# Altium schematic sheet Sheet2.SchDoc
size 420 x 297 mm; ApprovedBy: Судаков; CheckedBy: Сарайкин; Author: Аршаница; CompanyName: ООО "ОКБ Вектор"; Address1: Address1; Address2: Address2; Address3: Address3; Address4: Address4; DocumentNumber: ВГАР.426477.005 Э3; SheetNumber: 1; SheetTotal: 1; Scale: 1:1; ProcessInspection: Казанов; NormInspection: Коваленко; FirstReferrence: ВГАР.426477.005
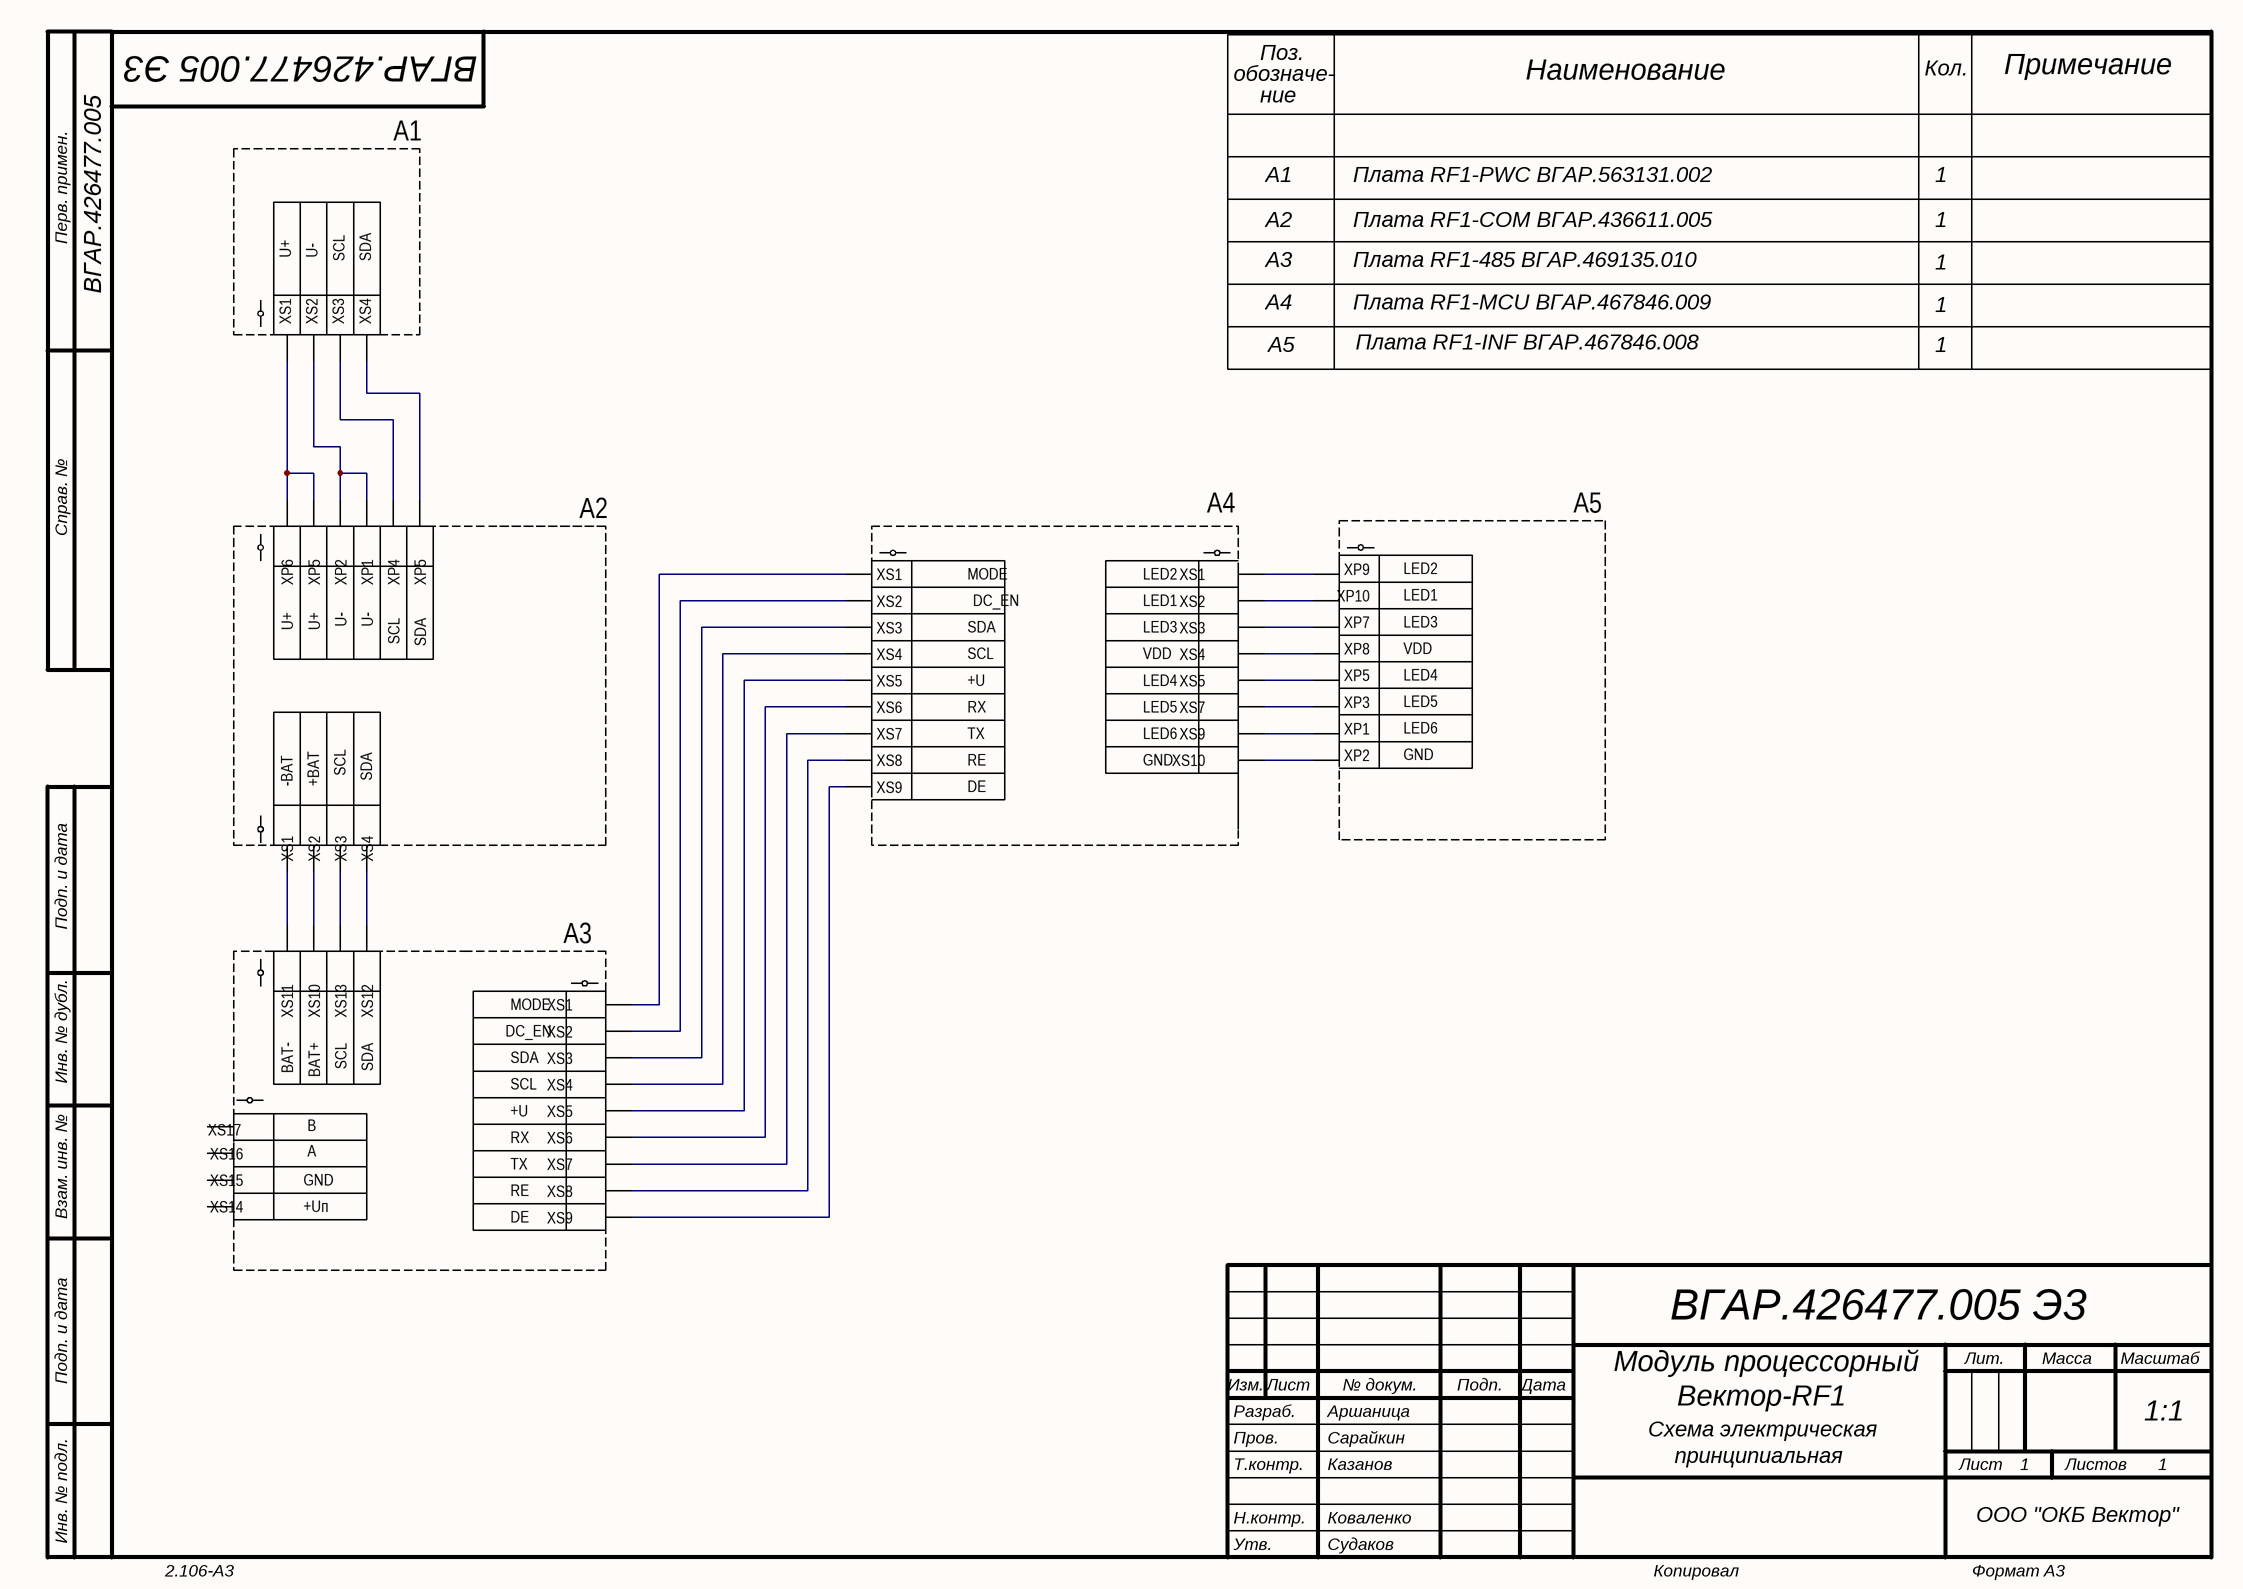
[diagram p0: Sheet2.SchDoc]

## Notes on the sheet
- обозначе-
- Поз.
- ние
- Наименование
- Кол.
- Примечание
- A1
- Плата RF1-PWC ВГАР.563131.002
- 1
- U+
- U-
- SCL
- SDA
- A2
- Плата RF1-COM ВГАР.436611.005
- XS1
- XS2
- XS3
- XS4
- A4
- A3
- Плата RF1-485 ВГАР.469135.010
- Плата RF1-MCU ВГАР.467846.009
- A5
- Плата RF1-INF ВГАР.467846.008
- XP6
- XP5
- XP2
- XP1
- XP4
- MODE
- LED2
- XP9
- XP10
- XS5
- DC_EN
- LED1
- LED3
- VDD
- XP7
- XP8
- XS6
- XS7
- +U
- RX
- LED4
- LED5
- XS9
- XP3
- LED6
- -BAT
- +BAT
- XS8
- TX
- RE
- DE
- GND
- XS10
- XS11
- XS13
- XS12
- BAT-
- BAT+
- XS17
- XS16
- B
- XS15
- XS14
- A
- +Uп
- Модуль процессорный
- Вектор-RF1
- Схема электрическая
- принципиальная
- Перв. примен.
- Справ. №
- Подп. и дата
- Инв. № дубл.
- Взам. инв. №
- Разраб.
- Изм.
- Лист
- № докум.
- Подп.
- Дата
- Лит.
- Масса
- Масштаб
- Пров.
- Т.контр.
- Листов
- Инв. № подл.
- Утв.
- Н.контр.
- 2.106-A3
- Копировал
- Формат А3